# Altium schematic sheet Communications.SchDoc
size 381 x 241 mm; SheetNumber: 4; SheetTotal: 6
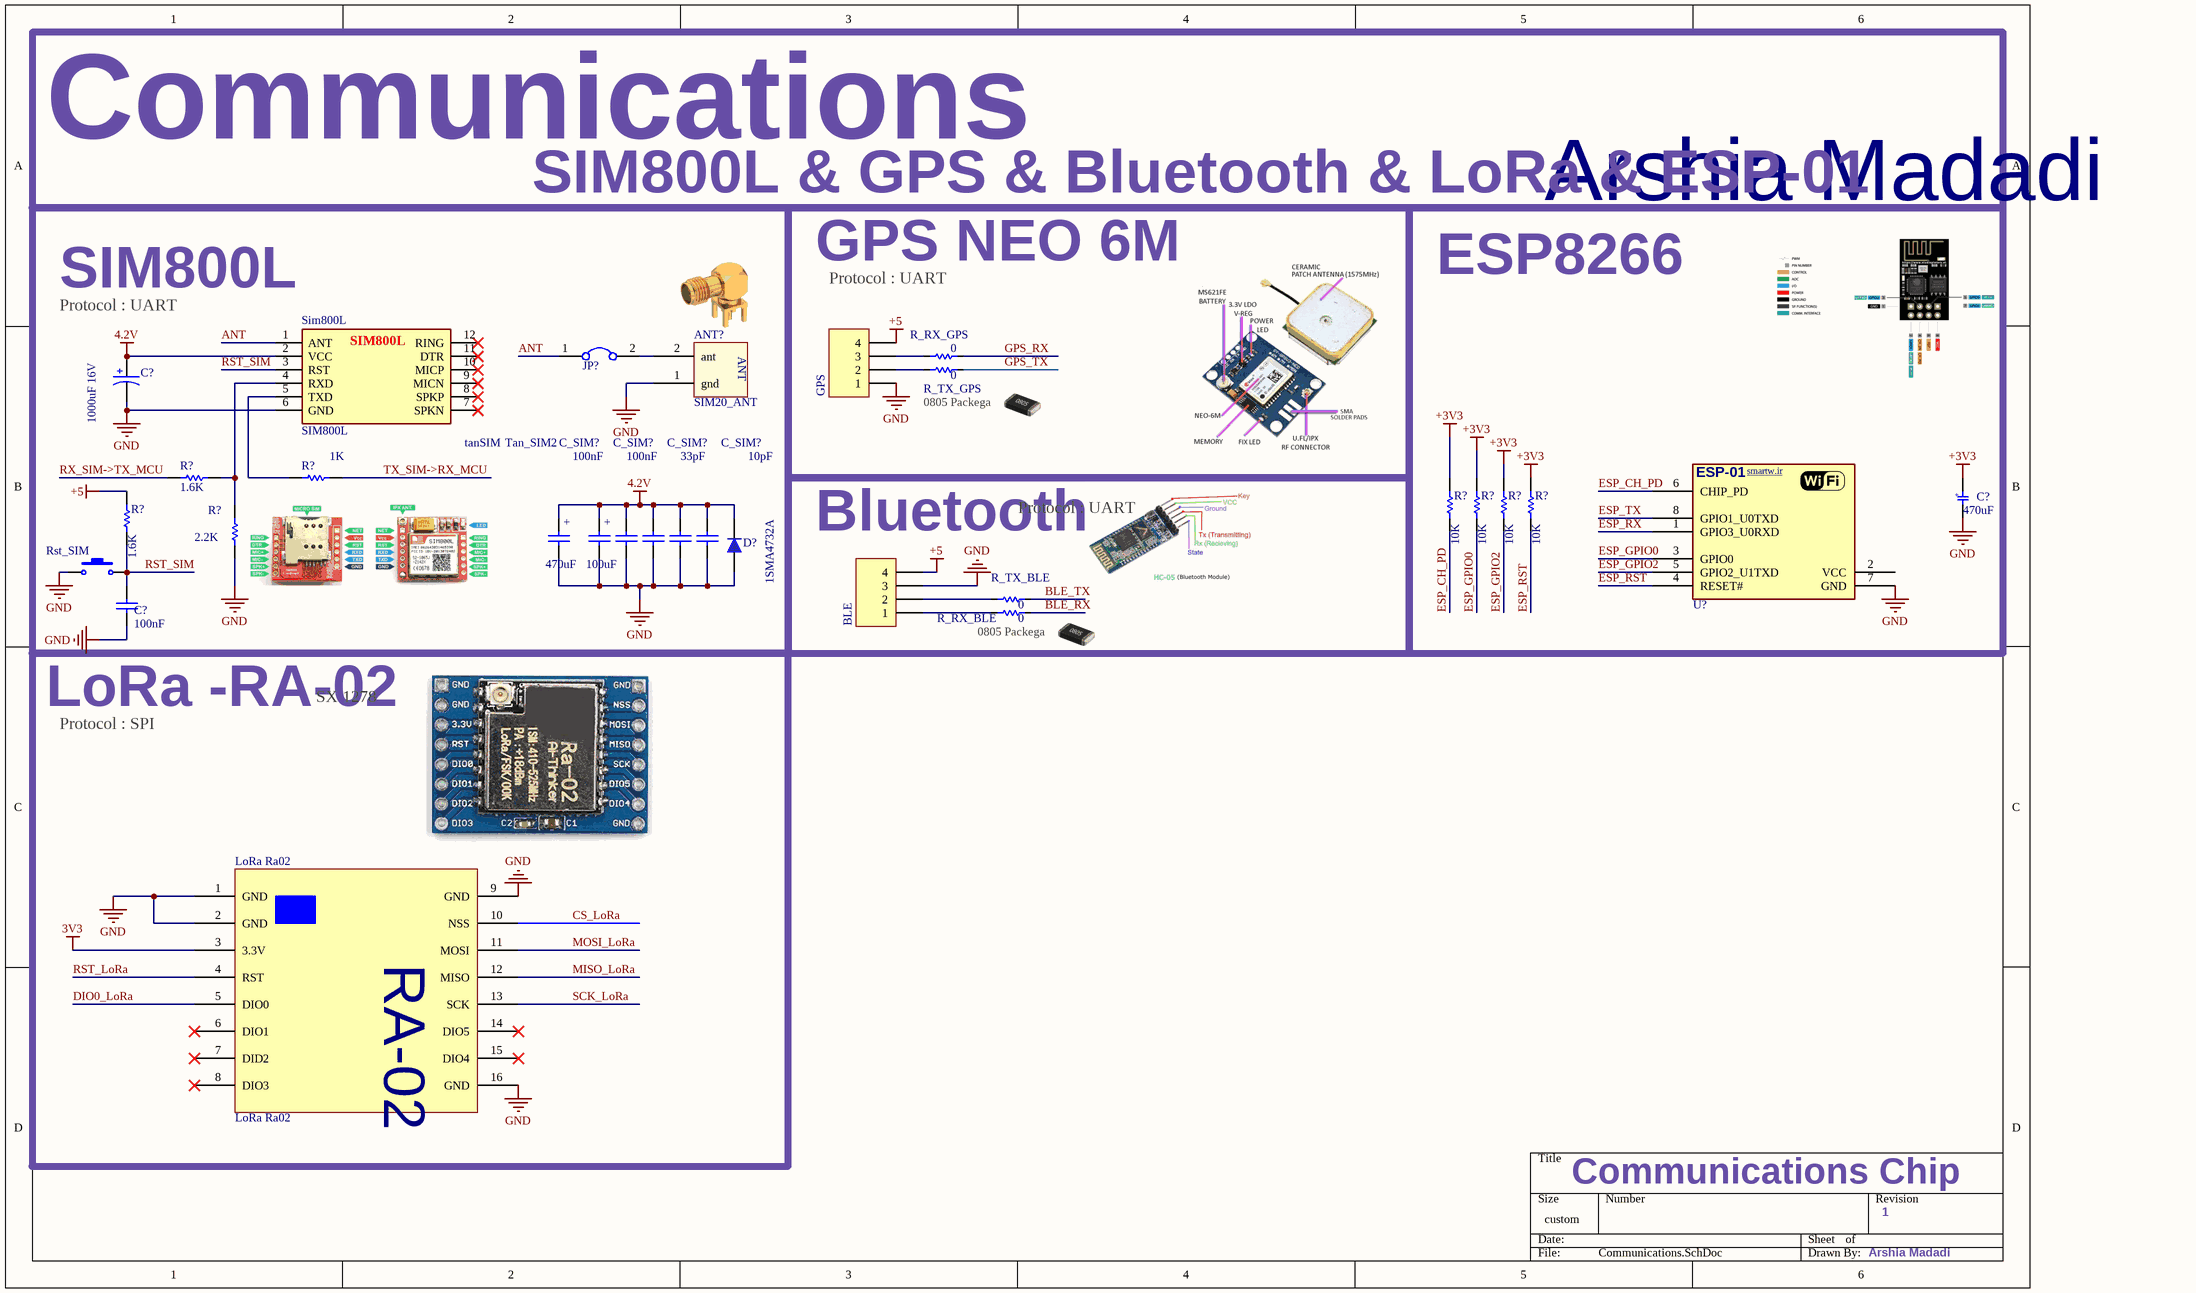
[diagram p0: Communications.SchDoc]

## Parts
(Parts that share a designator on the sheet are numbered #1, #2 ... from top to bottom, then left to right.)
100uF  Tan_SIM2  [MY_CAP_SMD-C]
470uF  tanSIM  [MY_CAP_SMD-C]
ANT?  SIM20_ANT  [MY_SIM20_ANT]
BLE  Header 4  [My_1X04]  (value not drawn)
C?#1  1000uF 16V  [SMD_1000uf 16V]
C?#2  470uF  [C_EL_10_10]
C?#3  100nF  [MY_CAP_SMD_0603]
C_SIM?#1  100nF  [CAP1206]
C_SIM?#2  100nF  [CAP1206]
C_SIM?#3  33pF  [CAP1206]
C_SIM?#4  10pF  [CAP1206]
D?  1SMA4732A  [SMA DIODE 2]
GPS  Header 4  [My_1X04]  (value not drawn)
JP?  Jumper  [Jumper Small - 2.54 - GRAY]  (value not drawn)
LoRa_Ra02  LoRa Ra02  [PCBComponent_1]
R?#1  1.6K  [RESC3413X04N]
R?#2  1K  [RESC3413X04N]
R?#3  10K  [RESC3413X04N]
R?#4  10K  [RESC3413X04N]
R?#5  10K  [RESC3413X04N]
R?#6  10K  [RESC3413X04N]
R?#7  1.6K  [RESC3413X04N]
R?#8  2.2K  [RESC3413X04N]
R_RX_BLE  0  [0805]
R_RX_GPS  0  [0805]
R_TX_BLE  0  [0805]
R_TX_GPS  0  [0805]
Rst_SIM  Switch PB  [SW-PB]  (value not drawn)
Sim800L  SIM800L  [SIM800L]
U?  ESP8266 ESP-01  [ESP8266_ESP01]  (value not drawn)

## Blocks framed on the sheet
SIM800L & GPS & Bluetooth & LoRa & ESP-01: 100uF 470uF ANT? C?#1 C?#3 C_SIM?#1-C_SIM?#4 D? JP? R?#1 R?#2 R?#7 R?#8 Rst_SIM Sim800L
GPS NEO 6M: GPS R_RX_GPS R_TX_GPS
Arshia Madadi: C?#2 R?#3-R?#6 U?
Bluetooth: BLE R_RX_BLE R_TX_BLE
LoRa -RA-02: LoRa_Ra02

## Nets
3V3: LoRa_Ra02.3(3.3V)
4.2V: 100uF.+ 470uF.+ C?#1.1 C_SIM?#1.1 C_SIM?#2.1 C_SIM?#3.1 C_SIM?#4.1 D?.2 Sim800L.2(VCC)
+3V3: C?#2.2 R?#3.2 R?#4.2 R?#5.2 R?#6.2
+5: BLE.4 GPS.4 R?#7.2
GND: 100uF.- 470uF.- ANT?.1(gnd) BLE.3 C?#1.2 C?#2.1 C?#3.2 C_SIM?#1.2 C_SIM?#2.2 C_SIM?#3.2 C_SIM?#4.2 D?.1 GPS.1 LoRa_Ra02.1(GND) LoRa_Ra02.2(GND) LoRa_Ra02.9(GND) LoRa_Ra02.16(GND) R?#8.2 Rst_SIM.1 Sim800L.6(GND) U?.7(GND)
ANT: JP?.1 Sim800L.1(ANT)
BLE_RX: R_RX_BLE.2
BLE_TX: R_TX_BLE.2
CS_LoRa: LoRa_Ra02.10(NSS)
DIO0_LoRa: LoRa_Ra02.5(DIO0)
ESP_CH_PD: R?#3.1 U?.6(CHIP_PD)
ESP_GPIO0: R?#4.1 U?.3(GPIO0)
ESP_GPIO2: R?#5.1 U?.5(GPIO2_U1TXD)
ESP_RST: R?#6.1 U?.4(RESET#)
ESP_RX: U?.1(GPIO3_U0RXD)
ESP_TX: U?.8(GPIO1_U0TXD)
GPS_RX: R_RX_GPS.2
GPS_TX: R_TX_GPS.2
MISO_LoRa: LoRa_Ra02.12(MISO)
MOSI_LoRa: LoRa_Ra02.11(MOSI)
RST_LoRa: LoRa_Ra02.4(RST)
RST_SIM: C?#3.1 R?#7.1 Rst_SIM.2 Sim800L.3(RST)
RX_SIM->TX_MCU: R?#1.2
SCK_LoRa: LoRa_Ra02.13(SCK)
TX_SIM->RX_MCU: R?#2.1
NetANT?_2: ANT?.2(ant) JP?.2
NetBLE_1: BLE.1 R_RX_BLE.1
NetBLE_2: BLE.2 R_TX_BLE.1
NetGPS_2: GPS.2 R_TX_GPS.1
NetGPS_3: GPS.3 R_RX_GPS.1
NetR?#1_1: R?#1.1 R?#8.1 Sim800L.4(RXD)
NetR?#2_2: R?#2.2 Sim800L.5(TXD)

Not connected (* = marked no-connect by the designer): LoRa_Ra02 6(DIO1)* 7(DID2)* 8(DIO3)* 14(DIO5)* 15(DIO4)*; Sim800L 7(SPKN)* 8(SPKP)* 9(MICN)* 10(MICP)* 11(DTR)* 12(RING)*; U? 2(VCC)

## Notes on the sheet
- Communications
- SIM800L
- Protocol : UART
- ESP8266
- 0805 Packega
- (near R_RX_BLE) 0805 Packega
- SX 1278
- Protocol : SPI
- Communications Chip
- 1
- Arshia Madadi
- (in symbol Capacitor) +
- (in symbol Capacitor Electrical SMD) +
- (in symbol Component_1) RA-02
- (in symbol ESP8266 ESP-01) smartw.ir; ESP-01

## Library data of the parts
100uF 470uF = CAP_TANTAL_C: 6X3.2MM; Value: 3300u
ANT? = SIM20_ANT: ANT
BLE GPS = Header 4: Header, 4-Pin; LatestRevisionDate: 17-Jul-2002; LatestRevisionNote: Re-released for DXP Platform.; Publisher: Altium Limited
C?#1 = Capacitor: Electrolyte Capacitor
C?#2 = Capacitor Electrical SMD: DatasheetVersion: 2021; ComponentLink1Description: Website Smart World; ComponentLink1URL: https://www.smartw.ir/; ComponentLink2Description: Telegram; ComponentLink2URL: https://t.me/altium_smartw; ComponentLink3Description: Instagram; ComponentLink3URL: https://Instagram.com/smartgw.ir
C?#3 = CAP SMD_0603: 1.6 mm × 0.8 mm
C_SIM?#1 C_SIM?#2 = CAP SMD PACKAGE: TOTAL CAPACITOR SMD PACK; Designer: Abbas Basereh; Desc.: CAP SMD TOTAL PACKAGES; Data: 2017-3-10; VALUE: 100nF
C_SIM?#3 C_SIM?#4 = CAP SMD PACKAGE: TOTAL CAPACITOR SMD PACK; Designer: Abbas Basereh; Desc.: CAP SMD TOTAL PACKAGES; VALUE: 100nF; Data: 2017-3-10
D? = Diode SMD Package: Diode SMD Pakage
JP? = Jumper: Company: E.P.I.L; Defualt State: Close; Design Date: 2011/11/02
LoRa_Ra02 = Component_1
R?#1-R?#8 = RES 0805 0.125W: RES 0805; Designer: Abbas Basereh; Desc.: RES SMD 0805; Data: 16-12-2016
R_RX_BLE R_RX_GPS R_TX_BLE R_TX_GPS = Res: Resistor; Published: 8-Jun-2000; LatestRevisionDate: 17-Jul-2002; LatestRevisionNote: Re-released for DXP Platform.; PackageReference: AXIAL-0.3; Publisher: Altium Limited
Rst_SIM = Switch PB: Push Button Switch
U? = ESP8266 ESP-01: ESP8266 ESP-01 WiFi Module; ComponentLink1Description: Website Smart World; ComponentLink1URL: https://www.smartw.ir/; ComponentLink2Description: Telegram; ComponentLink2URL: https://t.me/altium_smartw; ComponentLink3Description: Instagram; ComponentLink3URL: https://Instagram.com/smartgw.ir; DatasheetVersion: 2021
Sim800L = SIM800L: Publisher: 3DFootprint.ir